# Altium schematic sheet L298N.SchDoc
size B
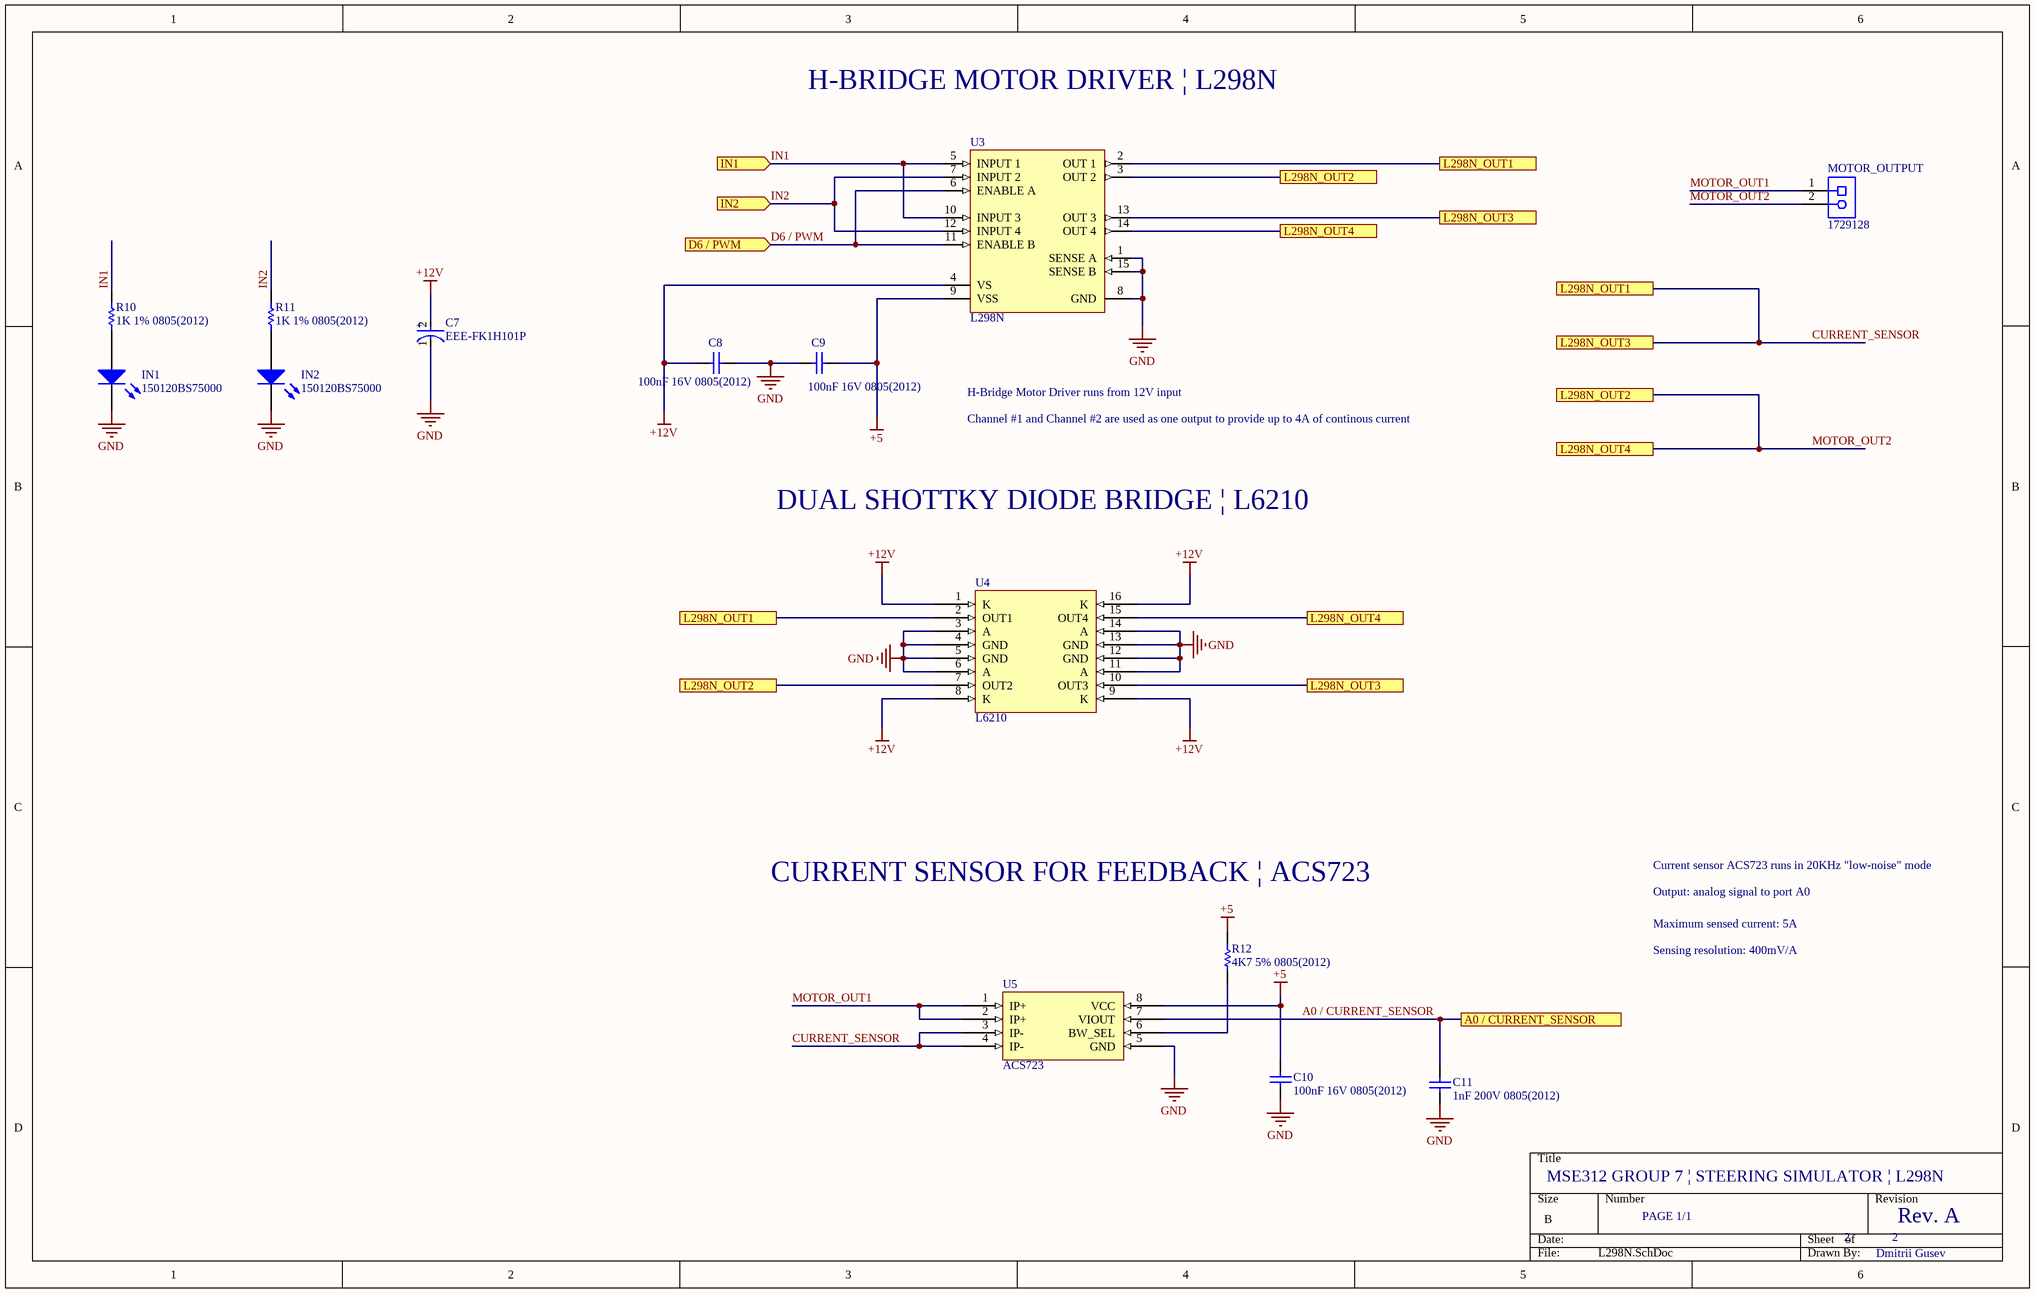
[diagram p0: L298N.SchDoc]

## Parts
C7  EEE-FK1H101P  [FP-EEE-FK1H101P-MFG]
C8  100nF 16V 0805(2012)  [CAPC0805(2012)100_L]
C9  100nF 16V 0805(2012)  [CAPC0805(2012)100_L]
C10  100nF 16V 0805(2012)  [CAPC0805(2012)100_L]
C11  1nF 200V 0805(2012)  [CAPC0805(2012)145_L]
IN1  150120BS75000  [1206_A]
IN2  150120BS75000  [1206_A]
MOTOR_OUTPUT  1729128  [PHOE-1729128-2_V]
R10  1K 1% 0805(2012)  [RESC0805(2012)_M]
R11  1K 1% 0805(2012)  [RESC0805(2012)_M]
R12  4K7 5% 0805(2012)  [RESC0805(2012)_N]
U3  L298N  [STM-FM-15]
U4  L6210  [L6210]
U5  ACS723  [ACS723]

## Ports
A0 / CURRENT_SENSOR, D6 / PWM (in), IN1 (in), IN2 (in), L298N_OUT1, L298N_OUT2, L298N_OUT3, L298N_OUT4

## Nets
+5: C9.2 C10.2 R12.2 U3.9(VSS) U5.8(VCC)
+12V: C7.2(A) C8.1 U3.4(VS) U4.1(K) U4.8(K) U4.9(K) U4.16(K)
GND: C7.1(C) C8.2 C9.1 C10.1 C11.1 IN1.1(K) IN2.1(K) U3.1(SENSE_A) U3.8(GND) U3.15(SENSE_B) U4.3(A) U4.4(GND) U4.5(GND) U4.6(A) U4.11(A) U4.12(GND) U4.13(GND) U4.14(A) U5.5(GND)
A0 / CURRENT_SENSOR: C11.2 U5.7(VIOUT) ; port A0 / CURRENT_SENSOR
CURRENT_SENSOR: U3.2(OUT_1) U3.13(OUT_3) U4.2(OUT1) U4.10(OUT3) U5.3(IP-) U5.4(IP-) ; port L298N_OUT1, port L298N_OUT3
D6 / PWM: U3.6(ENABLE_A) U3.11(ENABLE_B) ; port D6 / PWM
IN1: R10.2 U3.5(INPUT_1) U3.10(INPUT_3) ; port IN1
IN2: R11.2 U3.7(INPUT_2) U3.12(INPUT_4) ; port IN2
MOTOR_OUT1: MOTOR_OUTPUT.1 U5.1(IP+) U5.2(IP+)
MOTOR_OUT2: MOTOR_OUTPUT.2 U3.3(OUT_2) U3.14(OUT_4) U4.7(OUT2) U4.15(OUT4) ; port L298N_OUT2, port L298N_OUT4
NetIN1_2: IN1.2(A) R10.1
NetIN2_2: IN2.2(A) R11.1
NetR12_1: R12.1 U5.6(BW_SEL)

## Notes on the sheet
- H-BRIDGE MOTOR DRIVER | L298N
- H-Bridge Motor Driver runs from 12V input
- Channel #1 and Channel #2 are used as one output to provide up to 4A of continous current
- DUAL SHOTTKY DIODE BRIDGE | L6210
- CURRENT SENSOR FOR FEEDBACK | ACS723
- Current sensor ACS723 runs in 20KHz "low-noise" mode
- Output: analog signal to port A0
- Maximum sensed current: 5A
- Sensing resolution: 400mV/A
- MSE312 GROUP 7 | STEERING SIMULATOR | L298N
- PAGE 1/1
- 2
- Rev. A
- Dmitrii Gusev
- (in symbol CMP-05427-000005-1) +

## Library data of the parts
C7 = CMP-05427-000005-1: CAP ALUM 100UF 20% 50V SMD; Manufacturer: Panasonic Electronic Components; Automotive Grade: Grade 2; Dissipation Factor: 10%; Life: 2000Hours; Ripple Current: 350mA; Material: Aluminum; Esr: 0.34Ω; Leakage Current: 50uA; Tolerance: 20%; Package: 0; ComponentLink2URL: https://industrial.panasonic.com/cdbs/www-data/pdf/RDE0000/ABA0000C1181.pdf; Manufacturer Part Number: EEE-FK1H101P; Temperature Range Low: -55°C; Voltage Rating: 50V; ComponentLink2Description: Datasheet; Category: Cap; Digikey Description: CAP ALUM 100UF 20% 50V SMD; Octopart: https://octopart.com/eeefk1h101p-panasonic-4642841; Automotive: Yes; Temperature: -55°C to +105°C; Capacitance: 100uF; Lead Free: Yes; Mouser Description: Cap Aluminum Lytic 100uF 50V 20% (8 X 10.2mm) SMD 350mA 2000h 105C Automotive T/R; Height: 10.5mm; Device Class L3: Aluminum Electrolytic Capacitors; Value: 100uF; Device Class L1: Passive Components; RoHS: TRUE; Device Class L2: Capacitors; Temperature Range High: +105°C
C8-C10 = CMP-1036-04400-1: CAP 100nF 16V ±5% 0805 (2012 Metric) Thickness 1mm SMD; Case-EIA: 0805; Tolerance: Â±5%; Case-Metric: 2012; Max Thickness: 1 mm; Value: 100nF; Technology: SMT; Rated Voltage: 16 V
C11 = CMP-1036-02999-1: CAP 1nF 200V ±10% 0805 (2012 Metric) Thickness 1.45mm SMD; Tolerance: Â±10%; Case-Metric: 2012; Case-EIA: 0805; Technology: SMT; Max Thickness: 1.45 mm; Value: 1nF; Rated Voltage: 200 V
IN1 IN2 = CMP-1426-00015-1: SMD mono-color Chip LED, WL-SMCW, Blue; Manufacturer: Wuerth Elektronik; ComponentLink2Description: Datasheet; ComponentLink1URL: http://www.we-online.com; PartNumber: 150120BS75000; ComponentLink1Description: Manufacturer URL; ComponentLink2URL: http://katalog.we-online.com/led/datasheet/150120BS75000.pdf; PackageReference: 1206_A; Color: Blue
MOTOR_OUTPUT = CMP-2000-05815-1: PCB Terminal Block, 13.5 A, 400 V, 2-Pin THD, RoHS, Bulk; Manufacturer: Phoenix Contact; Package Version: 03/2015; No. of Rows: 1; Pitch: 5.08mm; No. of Positions: 2; Voltage Rating: 400V; Current Rating: 13500mA; Manufacturer URL: http://www.phoenixcontact.com/; Datasheet URL: https://datasheet.ciiva.com/16046/1729128-16046181.pdf; RoHS: TRUE; Package URL: https://www.phoenixcontact.com/online/portal/pi/pxc/product_detail_page/!ut/p/b1/3VdJjqNKFDxLH8AFycySyWY2ozFsEPOMMQaDOX1XedGL_1Vdm5YXJleknhSKeBkvI6EA8ncAo3AYoDhBQGco6KN7VURTdemj9us_IEKEZo_YHiPAEWEFmDGOHMORkqKYCORBZxgL7ZoaZYcbFFUZ3fqxSY6GOuxydWUuHqz1ynmMFygu583Bob0Ewr6Sd_l-5m-kAueHiB0jpRwZwe58wwtkpxtMYd_LmGcDRU02dRNEyWt6Y2ti5pSyJ_reIkzIulrqApdnbT11V5jnCKbYNCvhEM1MCpPByat_X379-iThf08CI5GfOPqfBeS3BRoBOdD55AKVv0iLwCMq-2BrzXWSGRH7pUGD9uwXQjiph3xL0DKQwdGa0JImiIOmBNOestqgwTHSSs2oOep-78apyXQBvNi8ZLaFjvjWvcaUEBu0MC6Wbe-d6mB0FAebo2lUWinqYaZs5DAYzV0RP9yitUjnGJ0iI9xhZkT42OCQNUJJhkgWINNQLP2JFP6OpMg3JCVg70jqHT0lvKOnhHf0lPuOnnLf0VPuWx6_dxwUIvwk5WMkT0kLL1mh61l2yZVSzG3pYV_bqo-mj6uMKwKwdnnW8Jh5RTOJzMOA5c-eJDaZQw4mTMPH02PvS_ZAqNVjVTo2WyYLkwH_KU1mmmG5kjRhDqPXLwwVHvVOjCM60-fpXvTDfMGW1PVFVS1r4e4yVDk4ZdNbkUHvqPqQSeian4UD39fNKmachqdJ1NJbyk8rXT9mXTvPk3oE5meulKGgiruPJek-4I9hTT6G8ZLOyRSm2RRVbThERQad5OS28hdt4YW4vG0stgYYzsWsK4_7y6DZMjJSCqri1kyiZR5vD7pwIrNR7QwPHTcLTI5qT7eRlpHrdGiupYlqQDJ7zy_CND8fWWBoLRXxk1RVcXiBQwbTD4Xi7KL-FuO94t9xaqweXzH; PartNumber: 1729128; Package Description: 2-Pin Through Hole Device, Body 8.1 x 10.16 mm, Pitch 5.08 mm; Datasheet Version: 12/2013; Mounting Technology: ThroughHole; Orientation: Horizontal; Package Reference: 1729128-2; Packing: Bulk
R10 R11 = CMP-1013-00510-1: 1K 0.125W 1% 0805 (2012 Metric)  SMD; Case-Metric: 2012; Value: 1000.00 Ohm; Case-EIA: 0805; Tolerance: 1 %; Power: 0.125 W; Technology: SMT
R12 = CMP-1013-00090-1: 4K7 0.125W 5% 0805 (2012 Metric)  SMD; Case-EIA: 0805; Value: 4700.00 Ohm; Case-Metric: 2012; Power: 0.125 W; Tolerance: 5 %; Technology: SMT
U3 = CMP-2000-06526-1: Dual Full-Bridge Driver, 4.8 to 46 V, -40 to 150 degC, 15-Pin FM (MW 15L), RoHS, Tube; Manufacturer: STMicroelectronics; PartNumber: L298; Output Current: 2A; Supply Voltage Max: 7V; Driver Case Style: Multiwatt; Supply Voltage Min: 4.5V; No. of Pins: 15Pins; SVHC: NoSVHC(17-Dec-2015); Output Voltage: 46V; No. of Outputs: 4Outputs; Motor Type: FullBridge; MSL: -; Package Description: 15-Pin Flange Mount, Body 5 x 19.6 mm, Pitch 1.27 mm; Datasheet Version: 01/2000; Package Reference: FM-15; Mounting Technology: ThroughHole; Packaging: Each; Automotive Qualification Standard: -; Product Range: -; Datasheet URL: https://datasheet.ciiva.com/15109/getdatasheetpartid-50682-15109332.pdf; Operating Temperature Max: 130°C; Operating Temperature Min: -25°C; Manufacturer URL: http://www.st.com/